# EAGLE design MDCC_512k (EAGLE 6.3)
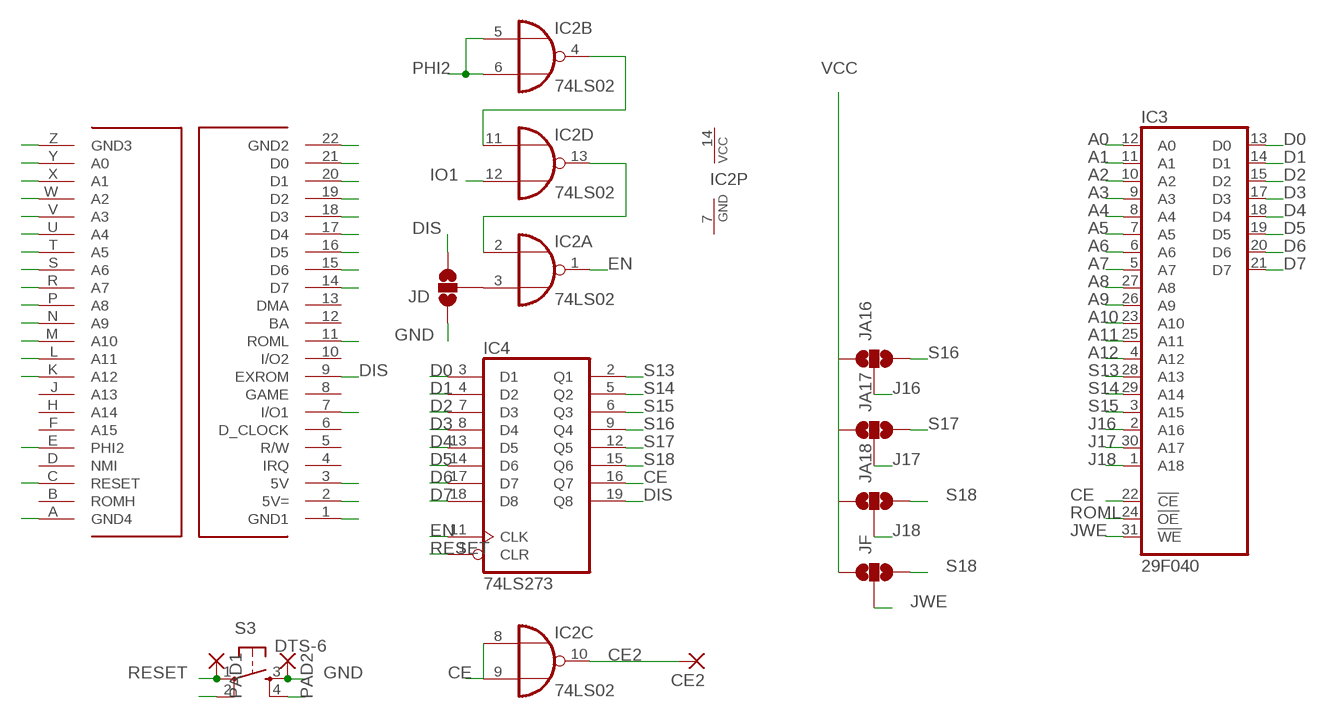
[diagram p0: schematic, sheet 1]

## Parts
CE2  1,6/0,9  [1,6/0,9]
IC2  74LS02  74LS02N  [DIL14]
IC3  29F040  AM29F040N  [DIL32-6]
IC4  74LS273  74HCT273N  [DIL20]
JA16  SOLDERJUMPER_2WAYS  [SJ_3]
JA17  SOLDERJUMPER_2WAYS  [SJ_3]
JA18  SOLDERJUMPER_2WAYS  [SJ_3]
JD  SOLDERJUMPER_2WAYS  [SJ_3]
JF  SOLDERJUMPER_2WAYS  [SJ_3]
PAD1  SMD5  [SMD2,54-5,08]
PAD2  SMD5  [SMD2,54-5,08]
S3  DTS-6  [DTS-6]
U$1  C64_EXPANSION__CARTRIDGE  [C64_EXPANSION__CARTRIDGE]

## Nets
A0: IC3.12(A0) U$1.Y(A0)
A1: IC3.11(A1) U$1.X(A1)
A2: IC3.10(A2) U$1.W(A2)
A3: IC3.9(A3) U$1.V(A3)
A4: IC3.8(A4) U$1.U(A4)
A5: IC3.7(A5) U$1.T(A5)
A6: IC3.6(A6) U$1.S(A6)
A7: IC3.5(A7) U$1.R(A7)
A8: IC3.27(A8) U$1.P(A8)
A9: IC3.26(A9) U$1.N(A9)
A10: IC3.23(A10) U$1.M(A10)
A11: IC3.25(A11) U$1.L(A11)
A12: IC3.4(A12) U$1.K(A12)
CE: IC2.8(C:I0) IC2.9(C:I1) IC3.22(!CE) IC4.16(Q7)
CE2: CE2.1(P) IC2.10(C:O)
D0: IC3.13(D0) IC4.3(D1) U$1.21(D0)
D1: IC3.14(D1) IC4.4(D2) U$1.20(D1)
D2: IC3.15(D2) IC4.7(D3) U$1.19(D2)
D3: IC3.17(D3) IC4.8(D4) U$1.18(D3)
D4: IC3.18(D4) IC4.13(D5) U$1.17(D4)
D5: IC3.19(D5) IC4.14(D6) U$1.16(D5)
D6: IC3.20(D6) IC4.17(D7) U$1.15(D6)
D7: IC3.21(D7) IC4.18(D8) U$1.14(D7)
DIS: IC4.19(Q8) JD.3 U$1.9(EXROM)
EN: IC2.1(A:O) IC4.11(CLK)
GND: JD.1 PAD2.1(P) S3.3 S3.4 U$1.1(GND1) U$1.22(GND2) U$1.A(GND4) U$1.Z(GND3)
IO1: IC2.12(D:I1) U$1.7(I/O1)
J16: IC3.2(A16) JA16.2
J17: IC3.30(A17) JA17.2
J18: IC3.1(A18) JA18.2
JWE: IC3.31(!WE) JF.2
N$1: IC2.3(A:I1) JD.2
N$7: IC2.4(B:O) IC2.11(D:I0)
N$9: IC2.2(A:I0) IC2.13(D:O)
PHI2: IC2.5(B:I0) IC2.6(B:I1) U$1.E(PHI2)
RESET: IC4.1(CLR) PAD1.1(P) S3.1 S3.2 U$1.C(RESET)
ROML: IC3.24(!OE) U$1.11(ROML)
S13: IC3.28(A13) IC4.2(Q1)
S14: IC3.29(A14) IC4.5(Q2)
S15: IC3.3(A15) IC4.6(Q3)
S16: IC4.9(Q4) JA16.3
S17: IC4.12(Q5) JA17.3
S18: IC4.15(Q6) JA18.3 JF.3
VCC: JA16.1 JA17.1 JA18.1 JF.1 U$1.2(5V=) U$1.3(5V)
Unconnected: U$1.4(IRQ) U$1.5(R/W) U$1.6(D_CLOCK) U$1.8(GAME) U$1.10(I/O2) U$1.12(BA) U$1.13(DMA) U$1.B(ROMH) U$1.D(NMI) U$1.F(A15) U$1.H(A14) U$1.J(A13)

## Power pins joined to a net without a drawn wire
GND: IC2.7(P:GND) IC3.16(GND) IC4.10(GND)
VCC: IC2.14(P:VCC) IC3.32(VCC) IC4.20(VCC)

## Library data of the parts
CE2 = wirepad:1,6/0,9: THROUGH-HOLE PAD
IC2 = 74xx-eu:74*02: Quad 2-input NOR gate
IC3 = 0RB_Memory:AM29F040: 4-Megabit FLASH MEMORY (512 K x 8 bit) 5 V-only
IC4 = 74xx-eu:74*273: Octal D type FLIP FLOP, clear
JA16-JA18 JD JF = SparkFun-Passives:SOLDERJUMPER_2WAY: Solder Jumper 2 way solder jumper
PAD1 PAD2 = wirepad:SMD5: SMD PAD
S3 = switch-tact:DTS-6
U$1 = 64kb_cart-twoboxes-short:C64_EXPANSION__CARTRIDGE

## Board
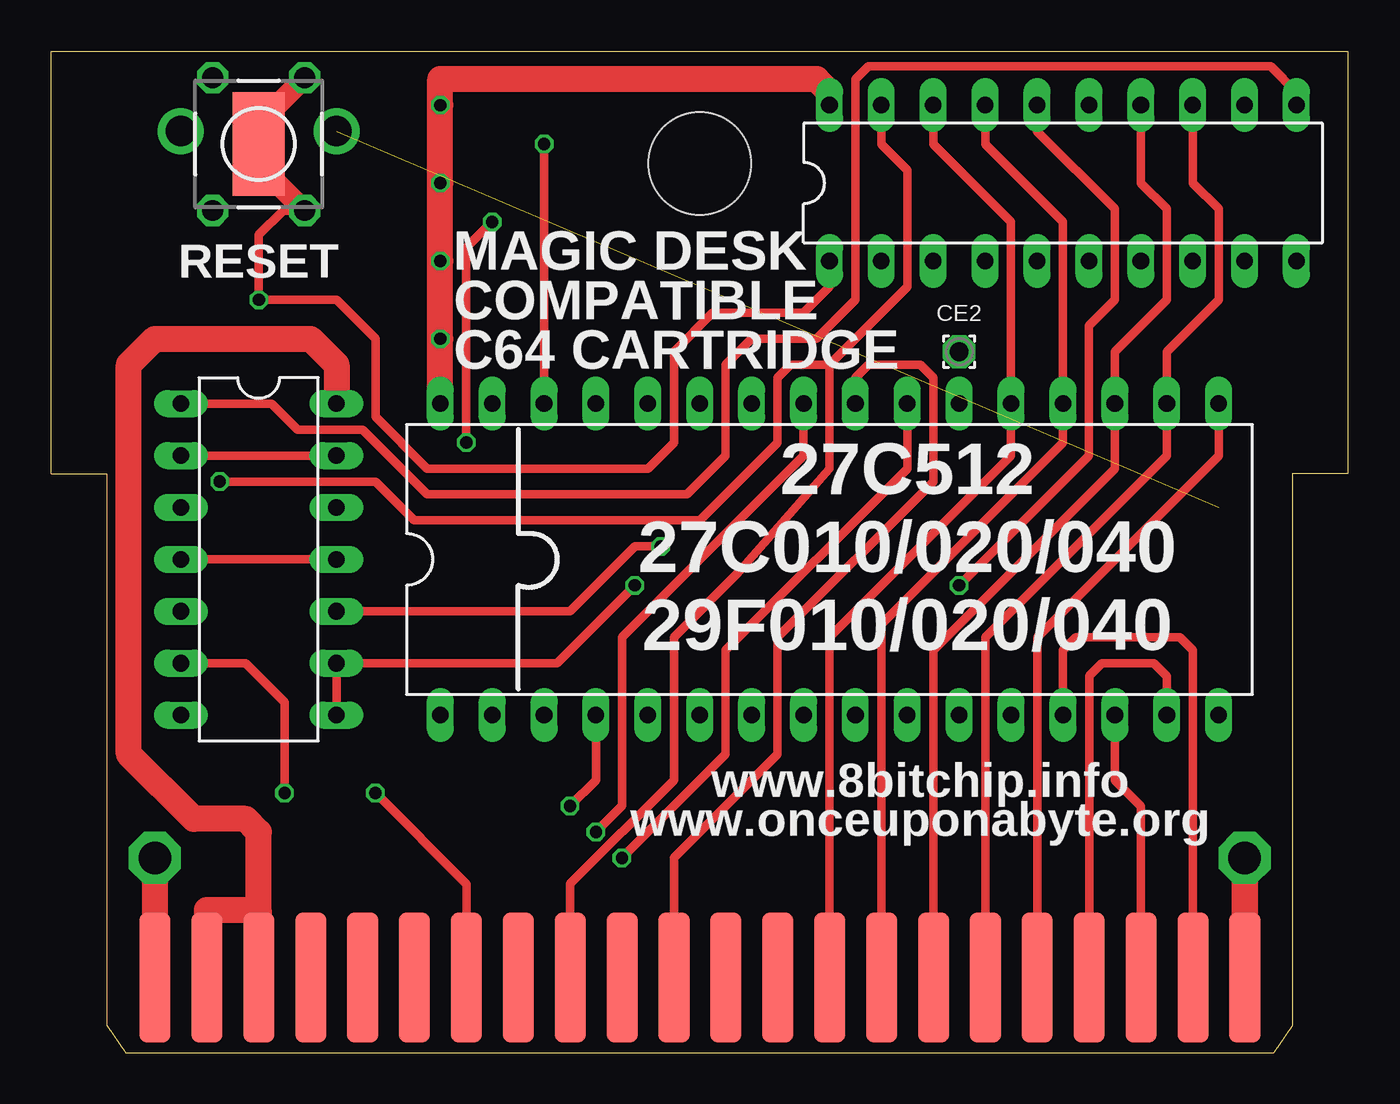
[diagram p1: board, top side]
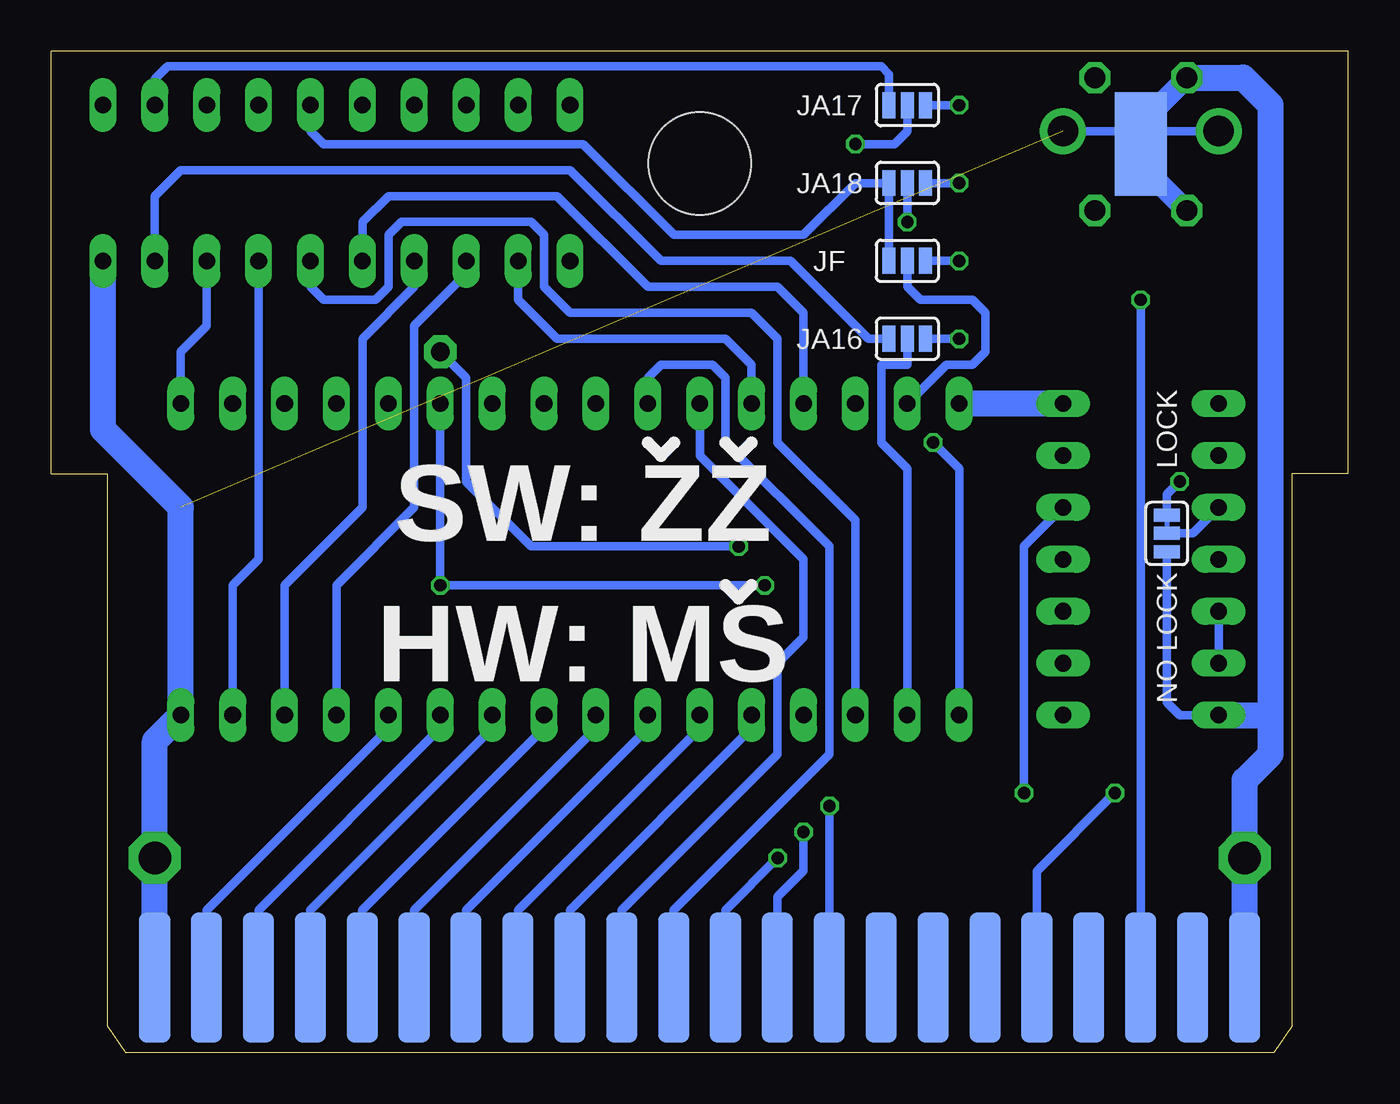
[diagram p2: board, bottom side, seen from below]

Size 63.5 x 49 mm. Coordinates in mm from the lower left corner, seen from the top.
Copper layers (1*16): Top 0.035mm / dielectric 1.5mm / Bottom 0.035mm
Design rules "dirt_cheap_dirty_boards.v1 *": minimum track width 5mil, minimum drill 12mil, track to track 8mil, track to pad 8mil, pad to pad 8mil, via to via 8mil, smd to smd 0mil, copper to edge 10mil, drill to drill 10mil, minimum pad ring 10mil, minimum via ring 6mil, stop-mask expansion 2mil, vias tented up to drill 25mil, thermal gap 10mil

### Footprints (pad centres in the part's own frame; a part is rotated, then mirrored left to right if it is on the bottom)
1,6/0,9 = drill 0.914 pad 1.6 octagon: 1 0,0
DIL14 = drill 0.813 long: 1 -7.62,-3.81; 2 -5.08,-3.81; 3 -2.54,-3.81; 4 0,-3.81; 5 2.54,-3.81; 6 5.08,-3.81; 7 7.62,-3.81; 8 7.62,3.81; 9 5.08,3.81; 10 2.54,3.81; 11 0,3.81; 12 -2.54,3.81; 13 -5.08,3.81; 14 -7.62,3.81
DIL32-6 = drill 0.813 long: 1 -19.05,-7.62; 2 -16.51,-7.62; 3 -13.97,-7.62; 4 -11.43,-7.62; 5 -8.89,-7.62; 6 -6.35,-7.62; 7 -3.81,-7.62; 8 -1.27,-7.62; 9 1.27,-7.62; 10 3.81,-7.62; 11 6.35,-7.62; 12 8.89,-7.62; 13 11.43,-7.62; 14 13.97,-7.62; 15 16.51,-7.62; 16 19.05,-7.62; 17 19.05,7.62; 18 16.51,7.62; 19 13.97,7.62; 20 11.43,7.62; 21 8.89,7.62; 22 6.35,7.62; 23 3.81,7.62; 24 1.27,7.62; 25 -1.27,7.62; 26 -3.81,7.62; 27 -6.35,7.62; 28 -8.89,7.62; 29 -11.43,7.62; 30 -13.97,7.62; 31 -16.51,7.62; 32 -19.05,7.62
DIL20 = drill 0.813 long: 1 -11.43,-3.81; 2 -8.89,-3.81; 3 -6.35,-3.81; 4 -3.81,-3.81; 5 -1.27,-3.81; 6 1.27,-3.81; 7 3.81,-3.81; 8 6.35,-3.81; 9 8.89,-3.81; 10 11.43,-3.81; 11 11.43,3.81; 12 8.89,3.81; 13 6.35,3.81; 14 3.81,3.81; 15 1.27,3.81; 16 -1.27,3.81; 17 -3.81,3.81; 18 -6.35,3.81; 19 -8.89,3.81; 20 -11.43,3.81
SJ_3 = smd 0.635 x 1.27: 1 -0.889,0; 2 0,0; 3 0.889,0
SMD2,54-5,08 = smd 2.54 x 5.08: 1 0,0
DTS-6 = drill 1.016 octagon: 1 -3.25,2.25; 2 3.25,2.25; 3 -3.25,-2.25; 4 3.25,-2.25
C64_EXPANSION__CARTRIDGE = smd 1.524 x 6.35: 1 5.09,3.675; 2 7.63,3.675; 3 10.17,3.675; 4 12.71,3.675; 5 15.25,3.675; 6 17.79,3.675; 7 20.33,3.675; 8 22.87,3.675; 9 25.41,3.675; 10 27.95,3.675; 11 30.49,3.675; 12 33.03,3.675; 13 35.57,3.675; 14 38.11,3.675; 15 40.65,3.675; 16 43.19,3.675; 17 45.73,3.675; 18 48.27,3.675; 19 50.81,3.675; 20 53.35,3.675; 21 55.89,3.675; 22 58.43,3.675 | smd 1.524 x 6.35 bottom: A 5.09,3.675; B 7.63,3.675; C 10.17,3.675; D 12.71,3.675; E 15.25,3.675; F 17.79,3.675; H 20.33,3.675; J 22.87,3.675; K 25.41,3.675; L 27.95,3.675; M 30.49,3.675; N 33.03,3.675; P 35.57,3.675; R 38.11,3.675; S 40.65,3.675; T 43.19,3.675; U 45.73,3.675; V 48.27,3.675; W 50.81,3.675; X 53.35,3.675; Y 55.89,3.675; Z 58.43,3.675 | hole 5: 31.75,43.5

### Placement (x,y rotation side)
CE2  44.45,34.29 0 top
IC2  10.16,24.13 270 top
IC3  38.1,24.13 0 top
IC4  49.53,42.55 0 top
JA16  21.59,34.92 180 bottom
JA17  21.59,46.35 180 bottom
JA18  21.59,42.55 180 bottom
JD  8.89,25.4 90 bottom
JF  21.59,38.73 180 bottom
PAD1  10.16,44.45 0 top
PAD2  10.16,44.45 180 bottom
S3  10.16,44.45 270 top
U$1  0,0 0 top

### Tracks (layer width: path | path; a pad name or v marks a point on that pad's centre or on a via)
A0
  Bottom 0.406: U$1.Y 55.89,6.97 46.99,15.88 IC3.12
A1
  Bottom 0.406: U$1.X 53.35,6.97 44.45,15.88 IC3.11
A2
  Bottom 0.406: U$1.W 50.81,6.97 41.91,15.88 IC3.10
A3
  Bottom 0.406: U$1.V 48.27,6.97 39.37,15.88 IC3.9
A4
  Bottom 0.406: U$1.U 45.73,6.97 36.83,15.88 IC3.8
A5
  Bottom 0.406: U$1.T 43.19,6.97 34.29,15.88 IC3.7
A6
  Bottom 0.406: U$1.S 40.65,6.97 31.75,15.88 IC3.6
A7
  Bottom 0.406: U$1.R 38.11,6.97 29.21,15.88 IC3.5
A8
  Bottom 0.406: U$1.P 35.57,6.97 27.94,14.61 27.94,19.05 26.67,20.32 26.67,24.13 31.75,29.21 IC3.27
A9
  Bottom 0.406: U$1.N 33.03,6.97 25.4,14.61 25.4,24.77 30.48,29.84 30.48,33.02 31.11,33.66 33.66,33.66 34.29,33.02 IC3.26
A10  (via drill 0.6 pad 0.81)
  Top 0.406: IC3.23 41.91,28.57 33.02,19.68 33.02,14.61 v27.94,9.53
  Bottom 0.406: U$1.M 30.49,6.97 v27.94,9.53
A11  (via drill 0.6 pad 0.81)
  Top 0.406: IC3.25 36.83,29.21 27.94,20.32 27.94,12.06 v26.67,10.79
  Bottom 0.406: v26.67,10.79 26.67,8.89 27.94,7.62 27.94,4.32 U$1.L
A12  (via drill 0.6 pad 0.81)
  Top 0.406: v25.4,12.06 26.67,13.34 IC3.4
  Bottom 0.406: U$1.K 25.41,6.97 v25.4,12.06
CE  (via drill 0.6, 0.6 pad 0.81)
  Top 0.406: IC4.16 48.26,45.09 52.07,41.27 52.07,36.83 50.8,35.56 50.8,29.21 v44.45,22.86 | IC2.8 IC2.9 24.77,19.05 v28.57,22.86
  Bottom 0.406: IC3.22 v44.45,22.86 v28.57,22.86
CE2  (via drill 0.6)
  Top 0.406: IC2.10 25.4,21.59 28.57,24.77 v29.84,24.77
  Bottom 0.406: v29.84,24.77 40.01,24.77 43.18,27.94 43.18,33.02 CE2.1
D0
  Top 0.406: U$1.21 55.89,19.68 55.24,20.32 50.16,20.32 49.53,19.68 IC3.13
  Bottom 0.406: IC4.3 43.18,38.1 45.72,35.56 45.72,26.67 49.53,22.86 IC3.13
D1
  Top 0.406: U$1.20 53.35,12.05 52.07,13.34 IC3.14
  Bottom 0.406: IC4.4 45.72,37.47 48.26,34.92 48.26,26.67 52.07,22.86 IC3.14
D2
  Top 0.406: U$1.19 50.81,18.43 51.44,19.05 53.98,19.05 54.61,18.41 IC3.15
  Bottom 0.406: IC4.7 53.34,24.13 54.61,22.86 IC3.15
D3
  Top 0.406: U$1.18 48.27,20.33 57.15,29.21 IC3.17
  Bottom 0.406: IC4.8 55.88,35.56 57.15,34.29 IC3.17
D4
  Top 0.406: U$1.17 45.73,20.33 54.61,29.21 IC3.18 54.61,34.29 57.15,36.83 57.15,41.27 55.88,42.55 IC4.13
D5
  Top 0.406: U$1.16 43.19,19.7 52.07,28.57 IC3.19 52.07,34.29 54.61,36.83 54.61,41.27 53.34,42.55 IC4.14
D6
  Top 0.406: U$1.15 40.65,20.96 49.53,29.84 IC3.20 49.53,40.64 45.72,44.45 IC4.17
D7
  Top 0.406: U$1.14 38.11,20.33 46.99,29.21 IC3.21 46.99,40.64 43.18,44.45 IC4.18
DIS  (via drill 0.6 pad 0.81)
  Top 0.406: v8.26,27.94 15.88,27.94 17.78,26.04 31.75,26.04 35.56,29.84 35.56,33.02 36.2,33.66 38.1,33.66 | U$1.9 25.41,8.27 | 25.41,8.27 30.48,13.34 30.48,20.32 33.66,23.5 38.1,28.57 38.1,33.66 | 25.41,8.27 25.39,8.27 | IC4.19 40.64,44.45 41.91,43.18 41.91,37.47 38.1,33.66
  Bottom 0.406: v8.26,27.94 8.89,27.3 JD.3
EN
  Top 0.406: IC2.1 10.79,31.75 12.06,30.48 15.24,30.48 18.41,27.3 31.11,27.3 33.02,29.21 33.02,33.66 34.29,34.92 37.47,34.92 39.37,36.83 39.37,47.62 40.01,48.26 59.69,48.26 60.96,46.99 IC4.11
GND  (via drill 1.5, 1.6 pad 2.54)  (1 unrouted)
  Top 1.27: U$1.A 5.09,9.52 v5.08,9.53 5.08,4.32 U$1.A | U$1.22 58.43,9.52 v58.42,9.53 58.42,4.32 U$1.22
  Bottom 0.406: v6.35,45.09 10.16,45.09 v13.97,45.09 | JD.1 8.89,17.14 8.26,16.51 IC2.7
  Bottom 1.016: S3.3 10.16,45.45 10.16,45.09 PAD2.1 10.16,43.45 S3.4
  Bottom 1.27: U$1.A 5.08,4.31 v5.08,9.53 5.08,13.34 3.81,14.61 3.81,16.51 | 3.81,16.51 3.81,46.35 5.16,47.7 S3.3 | IC2.7 3.81,16.51 | U$1.22 58.43,9.52 v58.42,9.53 58.42,15.24 IC3.16 57.15,26.67 60.96,30.48 IC4.10
IO1  (via drill 0.6)
  Top 0.406: U$1.7 20.33,8.24 v15.88,12.7
  Bottom 0.406: v15.88,12.7 15.88,24.77 IC2.12
J16
  Bottom 0.406: IC3.2 21.59,28.57 22.86,29.84 22.86,33.66 21.59,33.66 JA16.2
J17  (via drill 0.6 pad 0.81)
  Top 0.406: IC3.30 v24.13,44.45
  Bottom 0.406: v24.13,44.45 22.23,44.45 21.59,45.09 JA17.2
J18  (via drill 0.6 pad 0.81)
  Top 0.406: v20.32,29.84 20.32,39.37 v21.59,40.64
  Bottom 0.406: IC3.1 19.05,28.57 v20.32,29.84 | v21.59,40.64 JA18.2
JWE
  Bottom 0.406: JF.2 21.59,37.47 20.95,36.83 18.41,36.83 17.78,36.2 17.78,34.29 18.41,33.66 19.68,33.66 IC3.31
N$1
  Bottom 0.254: 8.89,26.04 JD.2
  Bottom 0.406: JD.2 7.62,25.4 IC2.3
N$7
  Top 0.406: IC2.4 IC2.11
N$9
  Top 0.406: IC2.2 IC2.13
PHI2  (via drill 0.6)
  Top 0.406: v11.43,12.7 11.43,17.14 9.53,19.05 IC2.6
  Bottom 0.406: IC2.5 IC2.6 | U$1.E 15.25,8.88 v11.43,12.7
RESET  (via drill 0.6 pad 0.81)
  Top 0.406: IC4.1 38.1,37.47 36.83,36.2 32.38,36.2 30.48,34.29 30.48,29.84 29.21,28.57 18.41,28.57 15.88,31.11 15.88,34.92 13.97,36.83 v10.17,36.83 v10.16,36.84 10.16,40.01 11.36,41.2 S3.2
  Top 1.016: S3.1 10.16,45.45 PAD1.1 10.16,43.45 S3.2
  Bottom 0.406: U$1.C v10.17,36.83 v10.16,36.84
ROML
  Top 0.406: U$1.11 30.49,9.54 35.56,14.61 35.56,20.32 43.18,27.94 43.18,33.02 42.55,33.66 40.01,33.66 39.37,33.02 IC3.24
S13
  Bottom 0.406: IC4.2 40.64,36.83 38.73,34.92 30.48,34.92 29.21,33.66 IC3.28
S14
  Bottom 0.406: IC4.5 48.26,40.64 46.99,41.91 38.73,41.91 34.29,37.47 27.94,37.47 26.67,36.2 IC3.29
S15
  Bottom 0.406: IC4.6 50.8,37.47 50.16,36.83 47.62,36.83 46.99,37.47 46.99,40.01 46.35,40.64 40.01,40.64 39.37,40.01 39.37,37.47 38.1,36.2 29.21,36.2 27.94,34.92 27.94,29.84 24.13,26.04 IC3.3
S16
  Bottom 0.406: IC4.9 58.42,41.91 57.15,43.18 38.1,43.18 33.66,38.73 27.3,38.73 23.5,34.92 JA16.3
S17
  Bottom 0.406: IC4.12 58.42,47.62 57.78,48.26 22.86,48.26 22.48,47.88 JA17.3
S18
  Bottom 0.406: IC4.15 50.8,45.09 50.16,44.45 37.47,44.45 33.02,40.01 26.67,40.01 24.13,42.55 JA18.3 JF.3
VCC  (via drill 0.6 pad 0.81)
  Top 1.27: U$1.2 7.63,6.97 7.62,6.99 10.16,6.99 10.16,4.32 U$1.3 10.17,10.79 9.53,11.43 6.99,11.43 3.81,14.61 3.81,33.66 5.08,34.92 12.7,34.92 13.97,33.66 IC2.14 | IC3.32 v19.05,34.92 v19.05,38.73 v19.05,42.55 v19.05,46.35 19.05,47.62 37.47,47.62 38.1,46.99 IC4.20
  Bottom 0.406: JA16.1 v19.05,34.92 | JF.1 v19.05,38.73 | JA18.1 v19.05,42.55 | JA17.1 v19.05,46.35
  Bottom 1.27: IC2.14 15.88,31.75 IC3.32

### Text on the board
tNames: RESET | MAGIC DESK / COMPATIBLE / C64 CARTRIDGE | 27C512 / 27C010/020/040 / 29F010/020/040 | www.8bitchip.info | www.onceuponabyte.org
bNames: LOCK | NO LOCK | SW: ZZ / HW: MS